# EAGLE design weblight (EAGLE 7.4.0)
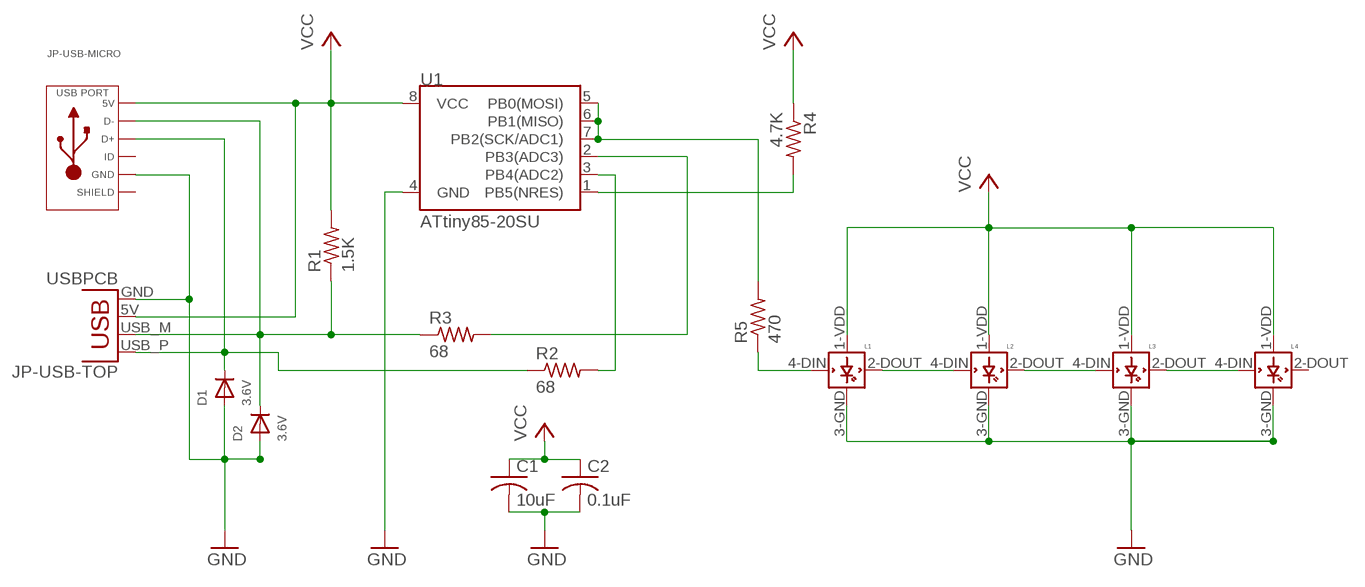
[diagram p0: schematic, sheet 1]

## Parts
C1  10uF  C-USC0402  [C0402]
C2  0.1uF  C-USC0402  [C0402]
D1  3.6V  DIODESOD-523  [SOD-523]
D2  3.6V  DIODESOD-523  [SOD-523]
JP-USB-MICRO  USB_MICRO_RIGHT  [MICROUSB-RIGHT]
JP-USB-TOP  USBPCB  [USB-A-PCB]
L1  WS2812B  [WS2812B]
L2  WS2812B  [WS2812B]
L3  WS2812B  [WS2812B]
L4  WS2812B  [WS2812B]
R1  1.5K  R-US_R0402  [R0402]
R2  68  R-US_R0402  [R0402]
R3  68  R-US_R0402  [R0402]
R4  4.7K  R-US_R0402  [R0402]
R5  470  R-US_R0402  [R0402]
U1  ATtiny85-20SU  ATTINY45TINY85-20-SMT  [SO08-EIAJ]

## Nets
DIN_1: L1.4-DIN(DIN) R5.1
DIN_2: L1.2-DOUT(DOUT) L2.4-DIN(DIN)
DIN_3: L2.2-DOUT(DOUT) L3.4-DIN(DIN)
DIN_4: L3.2-DOUT(DOUT) L4.4-DIN(DIN)
DIN_RAW: R5.2 U1.5(PB0(MOSI)) U1.6(PB1(MISO)) U1.7(PB2(SCK/ADC1))
GND: C1.2 C2.2 D1.A D2.A JP-USB-MICRO.5(GND) JP-USB-TOP.GND L1.3-GND(GND) L2.3-GND(GND) L3.3-GND(GND) L4.3-GND(GND) U1.4(GND)
N_RESET: R4.2 U1.1(PB5(NRES))
USB_D_MINUS: R3.2 U1.2(PB3(ADC3))
USB_D_MINUS_RAW: D2.K(C) JP-USB-MICRO.2(D-) JP-USB-TOP.USB_M(D-) R1.1 R3.1
USB_D_PLUS: R2.2 U1.3(PB4(ADC2))
USB_D_PLUS_RAW: D1.K(C) JP-USB-MICRO.3(D+) JP-USB-TOP.USB_P(D+) R2.1
VCC: C1.1 C2.1 JP-USB-MICRO.1(5V) JP-USB-TOP.5V(VBUS) L1.1-VDD(VDD) L2.1-VDD(VDD) L3.1-VDD(VDD) L4.1-VDD(VDD) R1.2 R4.1 U1.8(VCC)
Unconnected: JP-USB-MICRO.4(ID) L4.2-DOUT(DOUT)

## Power pins joined to a net without a drawn wire
SLD: JP-USB-MICRO.S1(SLD) JP-USB-MICRO.S2(SLD) JP-USB-MICRO.S3(SLD) JP-USB-MICRO.S4(SLD) JP-USB-MICRO.S5(SLD) JP-USB-MICRO.S6(SLD)

## Library data of the parts
C1 C2 = rcl:C-US: CAPACITOR, American symbol
D1 D2 = microbuilder:DIODE: Diode SMA Model Volts Amps Type Vf Vr Digikey # Notes SSA34-E3 40V 3A Schottky 480mV @ 3A 200uA @ 40V SSA34-E3/61TGITR-ND CDBA120-G 20V 1A Schottky 500mV @ 1A 500uA @ 20V 641-1014-6-ND REEL MBRA210 10V 2A Schottky 350mV @ 2A 700uA @ 10V MBRA210LT3 SOD-123 Model Volts Amps Type Vf Vr Order # Notes BAT54T1G 30V 200mA Schottky 800mV @ 200mA 2uA @ 25V BAT54T1GOSTR-ND B0530W 30V 500mA Schottky 430mV @ 500mA 130uA @ 30V B0530W-FDICT-ND REEL MBR120 1A 20V Schottky 340mV @ 1A MBR120VLSFT1GOSCT-ND SOD-323 Model Volts Amps Type Vf Vr Order # Notes PMEG2005EJ 20V 500mA Schottky 355mV @ 500mA 568-4110-1-ND ZLLS410 10V 570mA Schottky 380mV @ 570mA ZLLS410CT-ND 1N4148WS 75V 150mA Silicon/Simple 1V 1N4148WSFSCT-ND REEL SOD-523 Model Volts Amps Type Vf Vr Order # Notes BAT54XV2 30V 200mA Schottky 0.8V @ 100mA BAT54XV2CT-ND TB751S 30V 30mA Schottky RB751S-40TE61CT-ND SOT23-R/W (R = Solder Paste/Reflow Ovens, W = Hand-Soldering) Model Volts Amps Type Vf Vr Order # Notes BAT54FILM 40V 300mA Schottky 497-7162-1-ND
JP-USB-MICRO = MF_Connectors:USB: Library: MF_Connectors Description: 5 Pin USB Connectors. SLD is the shield connection. Usually tied to ground through a small ferrite bead.
JP-USB-TOP = SparkFun-Connectors:USB: USB Connectors USB-B-PTH is fully proven SKU : PRT-00139/CONN-08278 USB-miniB is fully proven SKU : PRT-00587 USB-A-PCB is untested. USB-A-H is throughly reviewed, but untested. Spark Fun Electronics SKU : PRT-00437 USB-B-SMT is throughly reviewed, but untested. Needs silkscreen touching up. USB-A-S has not been used/tested USB-MB-H has not been used/tested USB-MICROB has been used. CONN-09505
L1-L4 = weblight:WS2812B
R1-R5 = rcl:R-US_: RESISTOR, American symbol
U1 = SparkFun-DigitalIC:ATTINY45: Atmel 8-pin 2/4/8kB flash uC; PROD_ID: IC-09092; VALUE: Tiny85-20-SMT

## Board
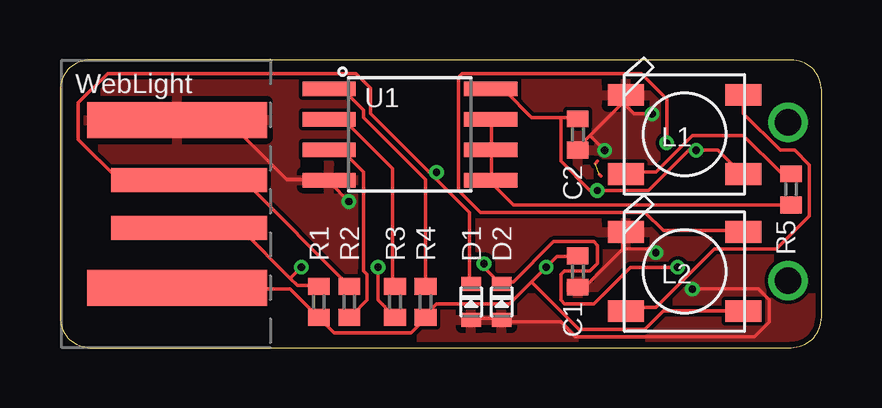
[diagram p1: board, top side]
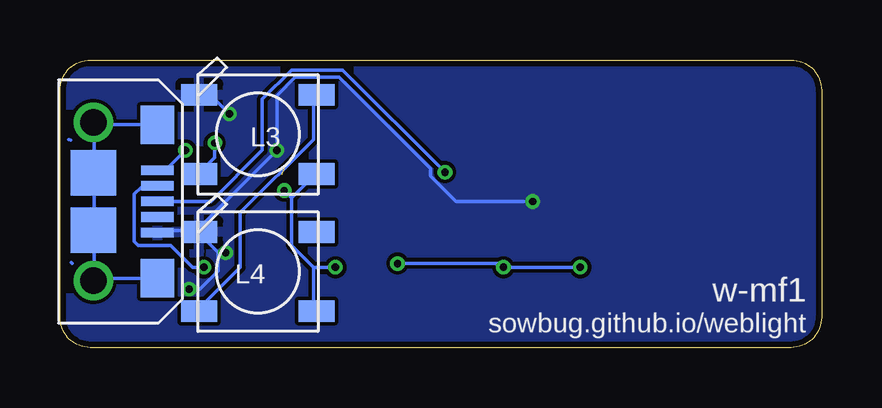
[diagram p2: board, bottom side, seen from below]

Size 31.75 x 12 mm. Coordinates in mm from the lower left corner, seen from the top.
Outline: 0,10.73 0,1.27 arc90 1.27,0 30.48,0 arc90 31.75,1.27 31.75,10.73 arc90 30.48,12 1.27,12 arc90 0,10.73
Copper layers (1*16): Top 0.035mm / dielectric 0.2mm / Bottom 0.035mm
Design rules "MacroFab_MF_2_Layer": minimum track width 6mil, minimum drill 12mil, track to track 6mil, track to pad 6mil, pad to pad 6mil, via to via 6mil, smd to smd 0mil, copper to edge 10mil, drill to drill 10mil, minimum pad ring 6mil, minimum via ring 6mil, stop-mask expansion 2mil, vias tented up to drill 25mil, thermal gap 10mil
vRestrict: area 0,0 to 8.9,12.1

### Footprints (pad centres in the part's own frame; a part is rotated, then mirrored left to right if it is on the bottom)
C0402 = smd 0.7 x 0.9: 1 -0.65,0; 2 0.65,0
SOD-523 = smd 0.8 x 0.6: A 0,-0.75; K 0,0.75
MICROUSB-RIGHT = smd 0.4 x 1.35: 1 -1.3,1.27; 2 -0.65,1.27; 3 0,1.27; 4 0.65,1.27; 5 1.3,1.27 | drill 1.1: S1 -3.3,-1.405; S2 3.3,-1.405 | smd 1.6 x 1.4: S3 -3.2,1.27; S4 3.2,1.27 | smd 1.9 x 1.9: S5 -1.2,-1.405; S6 1.2,-1.405
USB-A-PCB = smd 7.5 x 1.5: 5V -0.2,-3.5; GND -0.2,3.5 | smd 6.5 x 1: USB_M 0.3,-1; USB_P 0.3,1
WS2812B = smd 1.5 x 0.9: 1-VDD 2.45,-1.65; 2-DOUT 2.45,1.65; 3-GND -2.45,1.65; 4-DIN -2.45,-1.65
R0402 = smd 0.7 x 0.9: 1 -0.65,0; 2 0.65,0
SO08-EIAJ = smd 0.61 x 2.21: 1 -1.905,-3.378; 2 -0.635,-3.378; 3 0.635,-3.378; 4 1.905,-3.378; 5 1.905,3.353; 6 0.635,3.353; 7 -0.635,3.353; 8 -1.905,3.353

### Placement (x,y rotation side)
C1  21.59,3.17 270 top
C2  21.59,8.89 270 top
D1  17.14,1.91 0 top
D2  18.41,1.91 0 top
JP-USB-MICRO  28.96,6.1 270 bottom
JP-USB-TOP  5.08,6 0 top
L1  26.04,8.89 0 top
L2  26.04,3.17 0 top
L3  23.5,8.89 0 bottom
L4  23.5,3.17 0 bottom
R1  10.79,1.91 270 top
R2  12.06,1.91 270 top
R3  13.97,1.91 90 top
R4  15.24,1.91 90 top
R5  30.48,6.6 270 top
U1  14.61,8.89 270 top

### Tracks (layer width: path | path; a pad name or v marks a point on that pad's centre or on a via)
DIN_1
  Top 0.152: R5.1 30.48,7.32 30.02,7.32 28.5,8.84 26.36,8.84 24.84,7.32 23.62,7.32 L1.4-DIN
DIN_2
  Top 0.152: L2.4-DIN 23.62,1.68 24.84,1.68 27.28,4.12 29.87,4.12 31.24,5.49 31.24,7.62 30.63,8.23 30.02,8.23 28.5,9.75 28.5,10.52 L1.2-DOUT
DIN_3  (via drill 0.3)
  Top 0.152: v25.3,8.53 25.3,10.36 24.23,11.43 16.76,11.43 16.61,11.28 16.61,6.55 17.53,5.64 24.38,5.64 25.15,4.88 28.35,4.88 L2.2-DOUT
  Bottom 0.152: v25.3,8.53 25.3,7.92 25.91,7.32 L3.4-DIN
DIN_4
  Bottom 0.152: L3.2-DOUT 21.18,10.52 21.18,8.69 24.23,5.64 24.23,3.35 25.91,1.68 L4.4-DIN
DIN_RAW
  Top 0.152: U1.7 17.98,9.45 17.98,8.38 U1.6 17.98,8.23 17.98,7.01 U1.5 17.98,6.86 18.9,5.94 R5.2
GND  (via drill 0.3)
  Top 0.152: 23.47,10.21 22.1,8.84 | 22.1,8.84 21.64,8.38 C2.2 | 23.47,10.21 23.47,10.52 L1.3-GND 23.47,10.21 | v24.69,9.75 23.93,9.75 23.47,10.21 | 23.47,4.12 21.95,2.59 21.64,2.59 C1.2 | 23.47,4.12 23.47,4.72 L2.3-GND | D1.A 17.22,1.22 18.29,1.22 D2.A 18.44,1.07 20.88,1.07 21.49,0.46 28.96,0.46 29.57,1.07 29.57,1.98 29.11,2.44 v26.36,2.44 | 23.47,4.12 24.69,4.12 v24.84,3.96 | v22.71,8.23 22.1,8.84 | JP-USB-TOP.GND 5.03,9.45 7.01,9.45 9.45,7.01 11.12,7.01 U1.4 11.28,6.86 v12.04,6.1
  Bottom 0.152: v24.69,9.75 25.45,10.52 25.91,10.52 L3.3-GND | v26.36,2.44 25.91,2.44 25.15,3.2 25.15,3.96 | 25.15,3.96 25.91,4.72 L4.3-GND | 26.06,4.88 27.58,4.88 JP-USB-MICRO.5 | 26.06,4.88 L4.3-GND | 25.15,3.96 v24.84,3.96 | 26.06,4.88 v22.71,8.23 22.71,10.52 21.95,11.28 20.12,11.28 16.31,7.47 16.31,7.16 15.24,6.1 v12.04,6.1 | 26.06,4.88 L4.3-GND
  pour Bottom: -0.64,12.7 32.38,12.7 32.38,-0.64 -0.64,-0.64
  pour Top: -0.64,12.7 32.38,12.7 32.38,-0.64 -0.64,-0.64
N$1
  Bottom 0.152: 31.24,3.5 31.28,3.54 | 31.24,3.5 31.28,3.54 | 31.24,3.5 31.28,3.54 | 31.24,3.5 31.28,3.54
N$2
  Bottom 0.152: 31.39,8.69 31.29,8.66 | 31.39,8.69 31.29,8.66 | 31.39,8.69 31.29,8.66 | 31.39,8.69 31.29,8.66 | 31.39,8.69 31.29,8.66 | 31.39,8.69 31.29,8.66 | 31.39,8.69 31.29,8.66 | 31.39,8.69 31.29,8.66 | 31.39,8.69 31.29,8.66 | 31.39,8.69 31.29,8.66 | 31.39,8.69 31.29,8.66 | 31.39,8.69 31.29,8.66 | 31.39,8.69 31.29,8.66 | 31.39,8.69 31.29,8.66 | 31.39,8.69 31.29,8.66 | 31.39,8.69 31.29,8.66 | 31.39,8.69 31.29,8.66 | 31.39,8.69 31.29,8.66 | 31.39,8.69 31.29,8.66 | 31.39,8.69 31.29,8.66 | 31.39,8.69 31.29,8.66 | 31.39,8.69 31.29,8.66 | 31.39,8.69 31.29,8.66 | 31.39,8.69 31.29,8.66
N$3  (1 unrouted)
  Top 0.152: 22.4,7.77 22.33,7.67 | 22.4,7.77 22.33,7.67 | 22.4,7.77 22.33,7.67 | 22.4,7.77 22.33,7.67 | 22.4,7.77 22.33,7.67 | 22.4,7.77 22.33,7.67 | 22.4,7.77 22.33,7.67 | 22.4,7.77 22.33,7.67 | 22.4,7.77 22.33,7.67 | 22.4,7.77 22.33,7.67 | 22.4,7.77 22.33,7.67 | 22.4,7.77 22.33,7.67 | 22.4,7.77 22.33,7.67 | 22.4,7.77 22.33,7.67 | 22.4,7.77 22.33,7.67 | 22.4,7.77 22.33,7.67 | 22.4,7.77 22.33,7.67 | 22.4,7.77 22.33,7.67 | 22.4,7.77 22.33,7.67 | 22.4,7.77 22.33,7.67 | 22.4,7.77 22.33,7.67 | 22.4,7.77 22.33,7.67 | 22.4,7.77 22.33,7.67 | 22.4,7.77 22.33,7.67 | 22.55,7.16 22.48,7.21 | 22.55,7.16 22.48,7.21 | 22.55,7.16 22.48,7.21 | 22.55,7.16 22.48,7.21 | 22.55,7.16 22.48,7.21 | 22.55,7.16 22.48,7.21
N_RESET
  Top 0.152: R4.2 15.24,2.59 15.24,7.01 12.65,9.6 12.65,9.91 11.89,10.67 11.28,10.67 U1.1
SLD
  Bottom 0.152: 30.33,2.9 27.74,2.9 JP-USB-MICRO.S4 | 30.33,2.9 JP-USB-MICRO.S2 30.33,2.9 | 30.33,2.9 30.33,4.88 JP-USB-MICRO.S6 30.33,5.03 30.33,7.16 JP-USB-MICRO.S5 30.33,7.32 30.33,9.3 | 30.33,9.3 27.74,9.3 JP-USB-MICRO.S3 | 30.33,9.3 JP-USB-MICRO.S1 30.33,9.3
USB_D_MINUS
  Top 0.152: R3.2 13.87,2.59 13.87,7.47 11.89,9.45 11.28,9.45 U1.2
USB_D_MINUS_RAW  (via drill 0.3)
  Top 0.152: v25.76,3.35 23.77,3.35 22.25,1.83 21.03,1.83 20.88,1.98 20.88,3.05 21.03,3.2 22.1,3.2 22.4,3.5 22.4,4.27 22.25,4.42 20.57,4.42 18.9,2.74 18.44,2.74 D2.K 18.29,2.74 17.68,3.35 v17.68,3.5 | 9.6,2.9 7.62,4.88 5.49,4.88 JP-USB-TOP.USB_M | 9.6,2.9 9.91,2.59 10.67,2.59 R1.1 | v13.26,3.35 13.26,1.98 13.87,1.37 R3.1 | 9.6,2.9 v10.06,3.35
  Bottom 0.152: v25.76,3.35 26.21,3.35 27.13,4.27 28.5,4.27 28.65,4.42 28.65,6.4 28.35,6.71 27.74,6.71 JP-USB-MICRO.2 | v10.06,3.35 v13.26,3.35 13.41,3.5 v17.68,3.5
USB_D_PLUS
  Top 0.152: R2.2 12.19,1.37 12.8,1.98 12.8,3.05 12.65,3.2 12.65,7.32 11.73,8.23 11.28,8.23 U1.3
USB_D_PLUS_RAW  (via drill 0.3)
  Top 0.152: 15.54,7.16 12.95,9.75 12.95,10.82 12.34,11.43 1.98,11.43 0.76,10.21 0.76,8.69 2.44,7.01 5.33,7.01 JP-USB-TOP.USB_P 5.49,6.86 7.77,6.86 12.04,2.59 R2.1 | 15.54,7.16 17.07,5.64 17.07,2.74 D1.K | 15.54,7.16 v15.7,7.32
  Bottom 0.152: v15.7,7.32 19.96,11.58 22.1,11.58 23.32,10.36 23.32,8.23 25.45,6.1 27.58,6.1 JP-USB-MICRO.3
VCC  (via drill 0.3)
  Top 0.152: L1.1-VDD 28.35,7.32 27.43,8.23 v26.52,8.23 26.21,8.23 24.54,6.55 v22.4,6.55 22.1,6.55 20.88,7.77 20.88,9.6 | 20.88,9.6 19.66,9.6 18.59,10.67 17.98,10.67 U1.8 | 20.88,9.6 21.49,9.6 C2.1 | 19.66,2.74 18.75,1.83 15.7,1.83 15.24,1.37 R4.1 15.24,1.22 14.63,0.61 11.43,0.61 10.82,1.22 R1.2 10.67,1.37 9.6,2.44 5.03,2.44 JP-USB-TOP.5V | 19.66,2.74 v20.27,3.35 20.73,3.81 21.49,3.81 C1.1 | 19.66,2.74 21.64,0.76 24.38,0.76 25.15,1.52 28.35,1.52 L2.1-VDD
  Bottom 0.152: 21.18,3.35 21.18,1.68 L4.1-VDD | 21.18,3.35 22.1,4.27 22.1,6.25 | 22.1,6.25 21.18,7.16 L3.1-VDD | v26.52,8.23 27.28,7.47 27.58,7.47 JP-USB-MICRO.1 | v22.4,6.55 22.1,6.25 | v20.27,3.35 21.18,3.35

### Text on the board
tPlace: WebLight
bPlace: w-mf1 | sowbug.github.io/weblight